# EAGLE design mainboard (EAGLE 9.6.2)

## Sheet 1 of 3: CPU - GPU
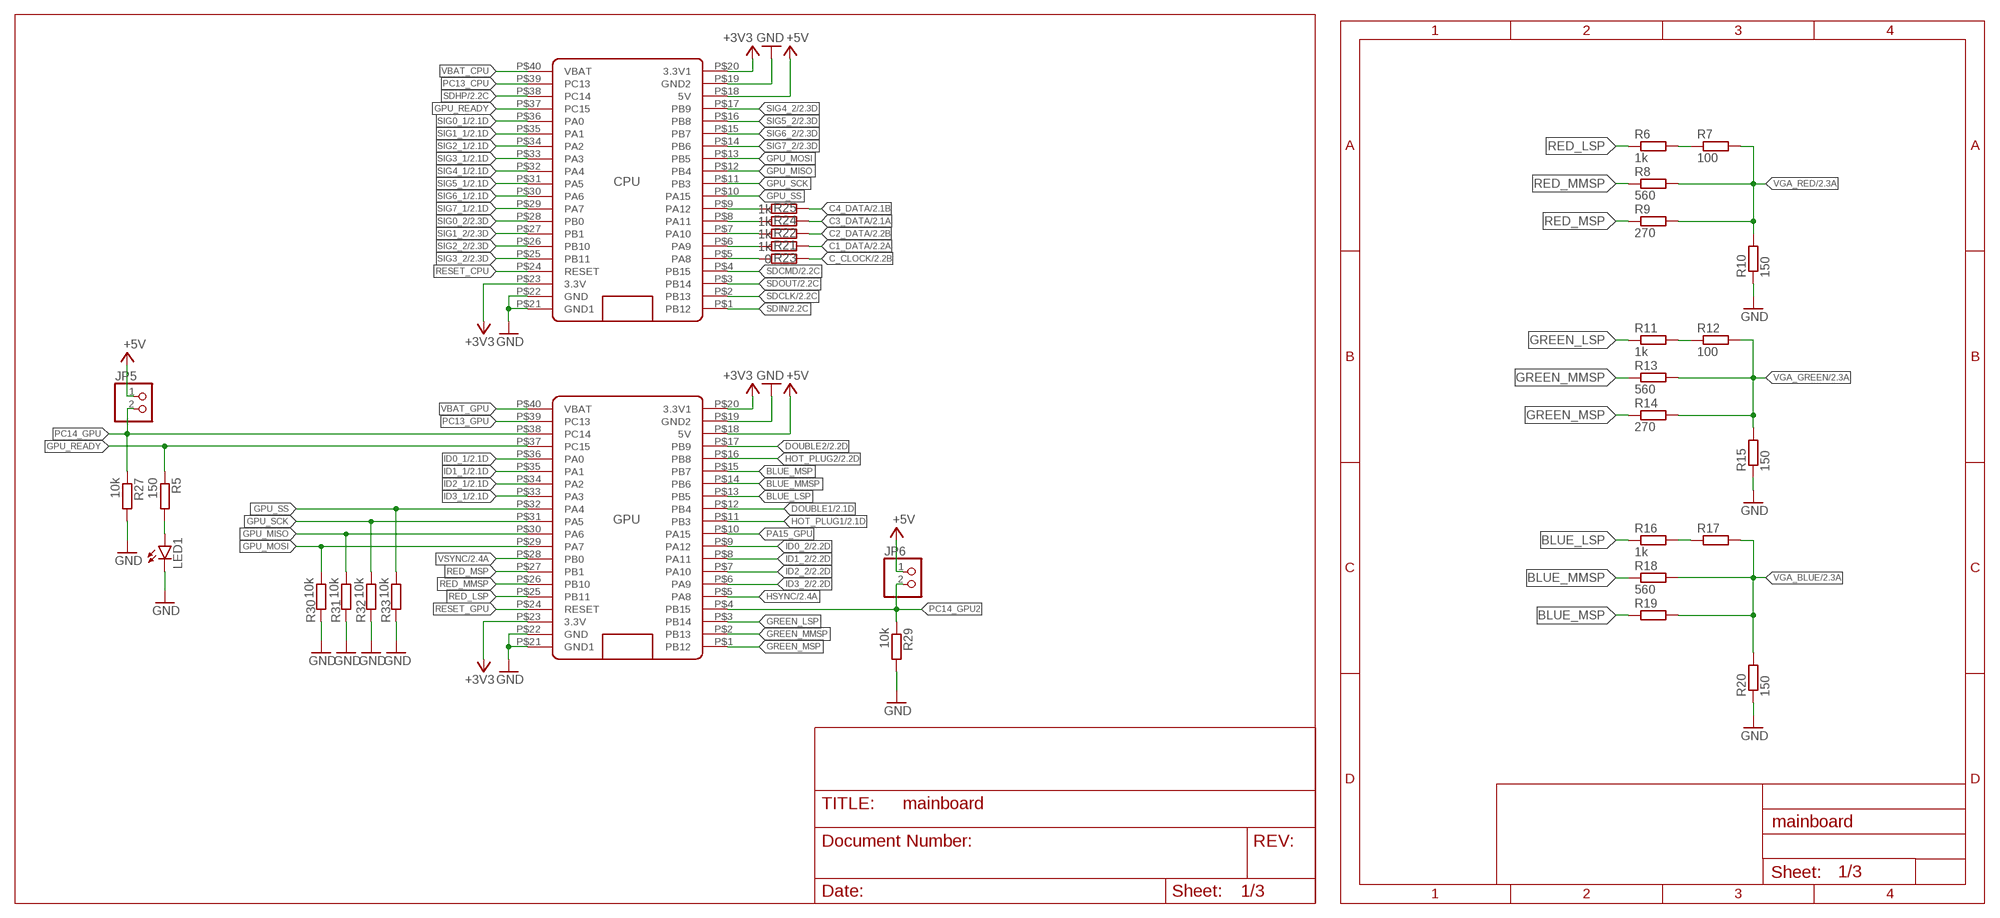
[diagram p0: schematic, sheet 1]

### Parts
CPU  BLUE_PILLADVANCED  [BLUE_PILL_ADV]
GPU  BLUE_PILLADVANCED  [BLUE_PILL_ADV]
JP5  PINHD-1X2  [1X02]
JP6  PINHD-1X2  [1X02]
LED1  LEDCHIPLED_0805  [CHIPLED_0805]
R5  150  R-EU_R0805  [R0805]
R6  1k  R-EU_R0805  [R0805]
R7  100  R-EU_R0805  [R0805]
R8  560  R-EU_R0805  [R0805]
R9  270  R-EU_R0805  [R0805]
R10  150  R-EU_R0805  [R0805]
R11  1k  R-EU_R0805  [R0805]
R12  100  R-EU_R0805  [R0805]
R13  560  R-EU_R0805  [R0805]
R14  270  R-EU_R0805  [R0805]
R15  150  R-EU_R0805  [R0805]
R16  1k  R-EU_R0805  [R0805]
R17  100  R-EU_R0805  [R0805]
R18  560  R-EU_R0805  [R0805]
R19  270  R-EU_R0805  [R0805]
R20  150  R-EU_R0805  [R0805]
R21  1k  R-EU_R0805  [R0805]
R22  1k  R-EU_R0805  [R0805]
R23  0  R-EU_R0805  [R0805]
R24  1k  R-EU_R0805  [R0805]
R25  1k  R-EU_R0805  [R0805]
R27  10k  R-EU_R0805  [R0805]
R29  10k  R-EU_R0805  [R0805]
R30  10k  R-EU_R0805  [R0805]
R31  10k  R-EU_R0805  [R0805]
R32  10k  R-EU_R0805  [R0805]
R33  10k  R-EU_R0805  [R0805]

### Nets
+3V3: CPU.P$20(3.3V1) CPU.P$23(3.3V) GPU.P$20(3.3V1) GPU.P$23(3.3V) ; also sheet 2
+5V: CPU.P$18(5V) GPU.P$18(5V) JP5.1 JP6.1 ; also sheet 2
BLUE_LSP: GPU.P$13(PB5) R16.1
BLUE_MMSP: GPU.P$14(PB6) R18.1
BLUE_MSP: GPU.P$15(PB7) R19.1
C1_DATA: R21.1 ; also sheet 2
C2_DATA: R22.1 ; also sheet 2
C3_DATA: R24.1 ; also sheet 2
C4_DATA: R25.1 ; also sheet 2
C_CLOCK: R23.1 ; also sheet 2
DOUBLE1: GPU.P$12(PB4) ; also sheet 2
DOUBLE2: GPU.P$17(PB9) ; also sheet 2
GND: CPU.P$19(GND2) CPU.P$21(GND1) CPU.P$22(GND) GPU.P$19(GND2) GPU.P$21(GND1) GPU.P$22(GND) LED1.C R10.1 R15.1 R20.1 R27.2 R29.2 R30.2 R31.2 R32.2 R33.2 ; also sheet 2
GPU_MISO: CPU.P$12(PB4) GPU.P$30(PA6) R31.1
GPU_MOSI: CPU.P$13(PB5) GPU.P$29(PA7) R30.1
GPU_READY: CPU.P$37(PC15) GPU.P$37(PC15) R5.1
GPU_SCK: CPU.P$11(PB3) GPU.P$31(PA5) R32.1
GPU_SS: CPU.P$10(PA15) GPU.P$32(PA4) R33.1
GREEN_LSP: GPU.P$3(PB14) R11.1
GREEN_MMSP: GPU.P$2(PB13) R13.1
GREEN_MSP: GPU.P$1(PB12) R14.1
HOT_PLUG1: GPU.P$11(PB3) ; also sheet 2
HOT_PLUG2: GPU.P$16(PB8) ; also sheet 2
HSYNC: GPU.P$5(PA8) ; also sheet 2
ID0_1: GPU.P$36(PA0) ; also sheet 2
ID0_2: GPU.P$9(PA12) ; also sheet 2
ID1_1: GPU.P$35(PA1) ; also sheet 2
ID1_2: GPU.P$8(PA11) ; also sheet 2
ID2_1: GPU.P$34(PA2) ; also sheet 2
ID2_2: GPU.P$7(PA10) ; also sheet 2
ID3_1: GPU.P$33(PA3) ; also sheet 2
ID3_2: GPU.P$6(PA9) ; also sheet 2
N$1: LED1.A R5.2
N$16: R6.2 R7.1
N$18: R11.2 R12.1
N$21: R16.2 R17.1
PA8_CPU: CPU.P$5(PA8) R23.2
PA9_CPU: CPU.P$6(PA9) R21.2
PA9_CPU1: CPU.P$8(PA11) R24.2
PA10_CPU: CPU.P$7(PA10) R22.2
PA10_CPU1: CPU.P$9(PA12) R25.2
PA15_GPU: GPU.P$10(PA15)
PC13_CPU: CPU.P$39(PC13)
PC13_GPU: GPU.P$39(PC13)
PC14_GPU: GPU.P$38(PC14) JP5.2 R27.1
PC14_GPU2: GPU.P$4(PB15) JP6.2 R29.1
RED_LSP: GPU.P$25(PB11) R6.1
RED_MMSP: GPU.P$26(PB10) R8.1
RED_MSP: GPU.P$27(PB1) R9.1
RESET_CPU: CPU.P$24(RESET)
RESET_GPU: GPU.P$24(RESET)
SDCLK: CPU.P$2(PB13) ; also sheet 2
SDCMD: CPU.P$4(PB15) ; also sheet 2
SDHP: CPU.P$38(PC14) ; also sheet 2
SDIN: CPU.P$1(PB12) ; also sheet 2
SDOUT: CPU.P$3(PB14) ; also sheet 2
SIG0_1: CPU.P$36(PA0) ; also sheet 2
SIG0_2: CPU.P$28(PB0) ; also sheet 2
SIG1_1: CPU.P$35(PA1) ; also sheet 2
SIG1_2: CPU.P$27(PB1) ; also sheet 2
SIG2_1: CPU.P$34(PA2) ; also sheet 2
SIG2_2: CPU.P$26(PB10) ; also sheet 2
SIG3_1: CPU.P$33(PA3) ; also sheet 2
SIG3_2: CPU.P$25(PB11) ; also sheet 2
SIG4_1: CPU.P$32(PA4) ; also sheet 2
SIG4_2: CPU.P$17(PB9) ; also sheet 2
SIG5_1: CPU.P$31(PA5) ; also sheet 2
SIG5_2: CPU.P$16(PB8) ; also sheet 2
SIG6_1: CPU.P$30(PA6) ; also sheet 2
SIG6_2: CPU.P$15(PB7) ; also sheet 2
SIG7_1: CPU.P$29(PA7) ; also sheet 2
SIG7_2: CPU.P$14(PB6) ; also sheet 2
VBAT_CPU: CPU.P$40(VBAT)
VBAT_GPU: GPU.P$40(VBAT)
VGA_BLUE: R17.2 R18.2 R19.2 R20.2 ; also sheet 2
VGA_GREEN: R12.2 R13.2 R14.2 R15.2 ; also sheet 2
VGA_RED: R7.2 R8.2 R9.2 R10.2 ; also sheet 2
VSYNC: GPU.P$28(PB0) ; also sheet 2

## Sheet 2 of 3: I/O
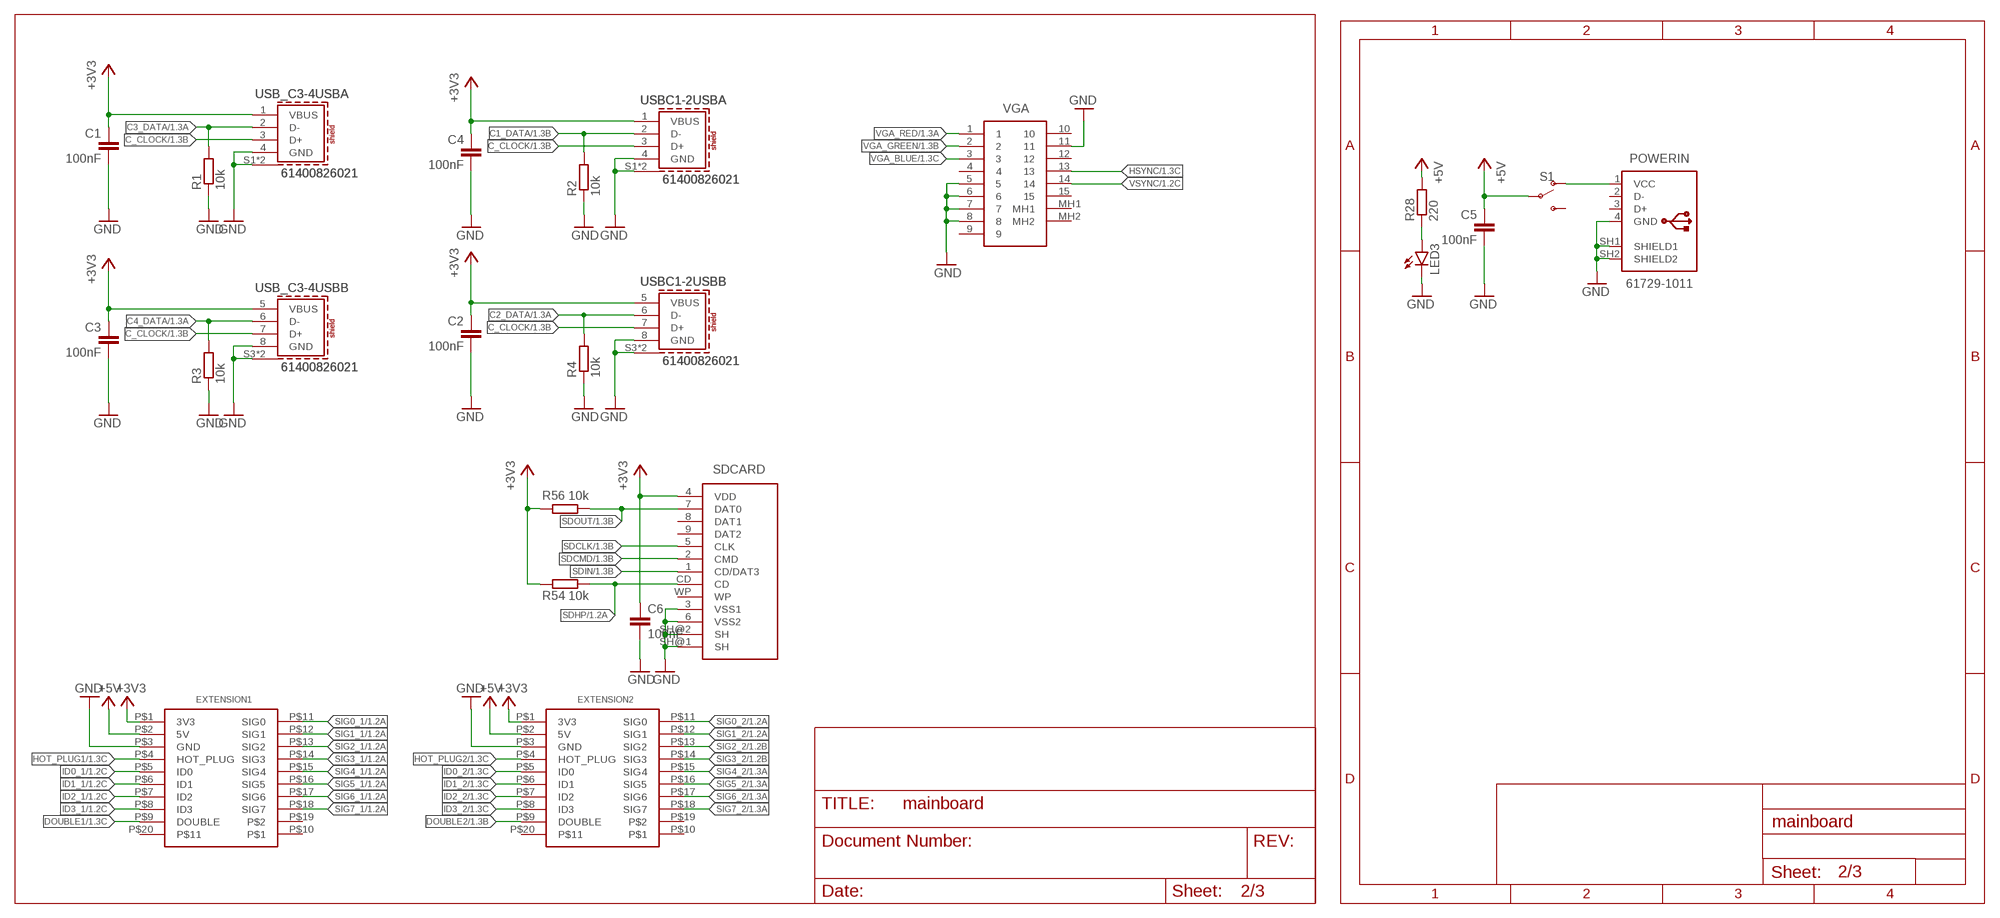
[diagram p1: schematic, sheet 2]

### Parts
C1  100nF  C-EUC0805  [C0805]
C2  100nF  C-EUC0805  [C0805]
C3  100nF  C-EUC0805  [C0805]
C4  100nF  C-EUC0805  [C0805]
C5  100nF  C-EUC0805  [C0805]
C6  100nF  C-EUC0805  [C0805]
EXTENSION1  3511220BMSS0BNA1_2.54MM_2X20_MALE  [3511220BMSS0BNA1_2.54MM_2X20_MALE]
EXTENSION2  3511220BMSS0BNA1_2.54MM_2X20_MALE  [3511220BMSS0BNA1_2.54MM_2X20_MALE]
LED3  LEDCHIPLED_0805  [CHIPLED_0805]
POWERIN  61729-1011  [61729-1011BLF]
R1  10k  R-EU_R0805  [R0805]
R2  10k  R-EU_R0805  [R0805]
R3  10k  R-EU_R0805  [R0805]
R4  10k  R-EU_R0805  [R0805]
R28  220  R-EU_R0805  [R0805]
R54  10k  R-EU_R0805  [R0805]
R56  10k  R-EU_R0805  [R0805]
S1  SWITCH-SPDT-PTH-11.6X4.0MM  [SWITCH_SPDT_PTH_11.6X4.0MM]
SD-CARD  SD_CARD_SOCKET  [SD]
USB_C3-4  61400826021  61400826021  [61400826021]
USBC1-2  61400826021  61400826021  [61400826021]
VGA  L77HDE15SD1CH4RHNVGA  [L77HDE15SD1CH4RHNVGA]

### Nets
+3V3: C1.1 C2.1 C3.1 C4.1 C6.1 EXTENSION1.P$1(3V3) EXTENSION2.P$1(3V3) R54.2 R56.2 SD-CARD.4(VDD) USB_C3-4.1(USBA:VBUS) USB_C3-4.5(USBB:VBUS) USBC1-2.1(USBA:VBUS) USBC1-2.5(USBB:VBUS) ; also sheet 1
+5V: C5.1 EXTENSION1.P$2(5V) EXTENSION2.P$2(5V) R28.2 S1.2(P) ; also sheet 1
C1_DATA: R2.2 USBC1-2.2(USBA:D-) ; also sheet 1
C2_DATA: R4.2 USBC1-2.6(USBB:D-) ; also sheet 1
C3_DATA: R1.2 USB_C3-4.2(USBA:D-) ; also sheet 1
C4_DATA: R3.2 USB_C3-4.6(USBB:D-) ; also sheet 1
C_CLOCK: USB_C3-4.3(USBA:D+) USB_C3-4.7(USBB:D+) USBC1-2.3(USBA:D+) USBC1-2.7(USBB:D+) ; also sheet 1
DOUBLE1: EXTENSION1.P$9(DOUBLE) ; also sheet 1
DOUBLE2: EXTENSION2.P$9(DOUBLE) ; also sheet 1
GND: C1.2 C2.2 C3.2 C4.2 C5.2 C6.2 EXTENSION1.P$3(GND) EXTENSION2.P$3(GND) LED3.C POWERIN.4(GND) POWERIN.SH1(SHIELD1) POWERIN.SH2(SHIELD2) R1.1 R2.1 R3.1 R4.1 SD-CARD.3(VSS1) SD-CARD.6(VSS2) SD-CARD.SH@1(SH) SD-CARD.SH@2(SH) USB_C3-4.4(USBA:GND) USB_C3-4.8(USBB:GND) USB_C3-4.S1(USBA:SHIELD) USB_C3-4.S2(USBA:SHIELD) USB_C3-4.S3(USBB:SHIELD) USB_C3-4.S4(USBB:SHIELD) USBC1-2.4(USBA:GND) USBC1-2.8(USBB:GND) USBC1-2.S1(USBA:SHIELD) USBC1-2.S2(USBA:SHIELD) USBC1-2.S3(USBB:SHIELD) USBC1-2.S4(USBB:SHIELD) VGA.5 VGA.6 VGA.7 VGA.8 VGA.11 ; also sheet 1
HOT_PLUG1: EXTENSION1.P$4(HOT_PLUG) ; also sheet 1
HOT_PLUG2: EXTENSION2.P$4(HOT_PLUG) ; also sheet 1
HSYNC: VGA.13 ; also sheet 1
ID0_1: EXTENSION1.P$5(ID0) ; also sheet 1
ID0_2: EXTENSION2.P$5(ID0) ; also sheet 1
ID1_1: EXTENSION1.P$6(ID1) ; also sheet 1
ID1_2: EXTENSION2.P$6(ID1) ; also sheet 1
ID2_1: EXTENSION1.P$7(ID2) ; also sheet 1
ID2_2: EXTENSION2.P$7(ID2) ; also sheet 1
ID3_1: EXTENSION1.P$8(ID3) ; also sheet 1
ID3_2: EXTENSION2.P$8(ID3) ; also sheet 1
N$3: POWERIN.1(VCC) S1.1(O)
N$4: LED3.A R28.1
SDCLK: SD-CARD.5(CLK) ; also sheet 1
SDCMD: SD-CARD.2(CMD) ; also sheet 1
SDHP: R54.1 SD-CARD.CD ; also sheet 1
SDIN: SD-CARD.1(CD/DAT3) ; also sheet 1
SDOUT: R56.1 SD-CARD.7(DAT0) ; also sheet 1
SIG0_1: EXTENSION1.P$11(SIG0) ; also sheet 1
SIG0_2: EXTENSION2.P$11(SIG0) ; also sheet 1
SIG1_1: EXTENSION1.P$12(SIG1) ; also sheet 1
SIG1_2: EXTENSION2.P$12(SIG1) ; also sheet 1
SIG2_1: EXTENSION1.P$13(SIG2) ; also sheet 1
SIG2_2: EXTENSION2.P$13(SIG2) ; also sheet 1
SIG3_1: EXTENSION1.P$14(SIG3) ; also sheet 1
SIG3_2: EXTENSION2.P$14(SIG3) ; also sheet 1
SIG4_1: EXTENSION1.P$15(SIG4) ; also sheet 1
SIG4_2: EXTENSION2.P$15(SIG4) ; also sheet 1
SIG5_1: EXTENSION1.P$16(SIG5) ; also sheet 1
SIG5_2: EXTENSION2.P$16(SIG5) ; also sheet 1
SIG6_1: EXTENSION1.P$17(SIG6) ; also sheet 1
SIG6_2: EXTENSION2.P$17(SIG6) ; also sheet 1
SIG7_1: EXTENSION1.P$18(SIG7) ; also sheet 1
SIG7_2: EXTENSION2.P$18(SIG7) ; also sheet 1
VGA_BLUE: VGA.3 ; also sheet 1
VGA_GREEN: VGA.2 ; also sheet 1
VGA_RED: VGA.1 ; also sheet 1
VSYNC: VGA.14 ; also sheet 1
Unconnected: EXTENSION1.P$10 EXTENSION1.P$19 EXTENSION1.P$20 EXTENSION2.P$10 EXTENSION2.P$19 EXTENSION2.P$20 POWERIN.2(D-) POWERIN.3(D+) S1.3(S) SD-CARD.8(DAT1) SD-CARD.9(DAT2) SD-CARD.WP VGA.4 VGA.9 VGA.10 VGA.12 VGA.15 VGA.MH1 VGA.MH2

## Sheet 3 of 3: Controller
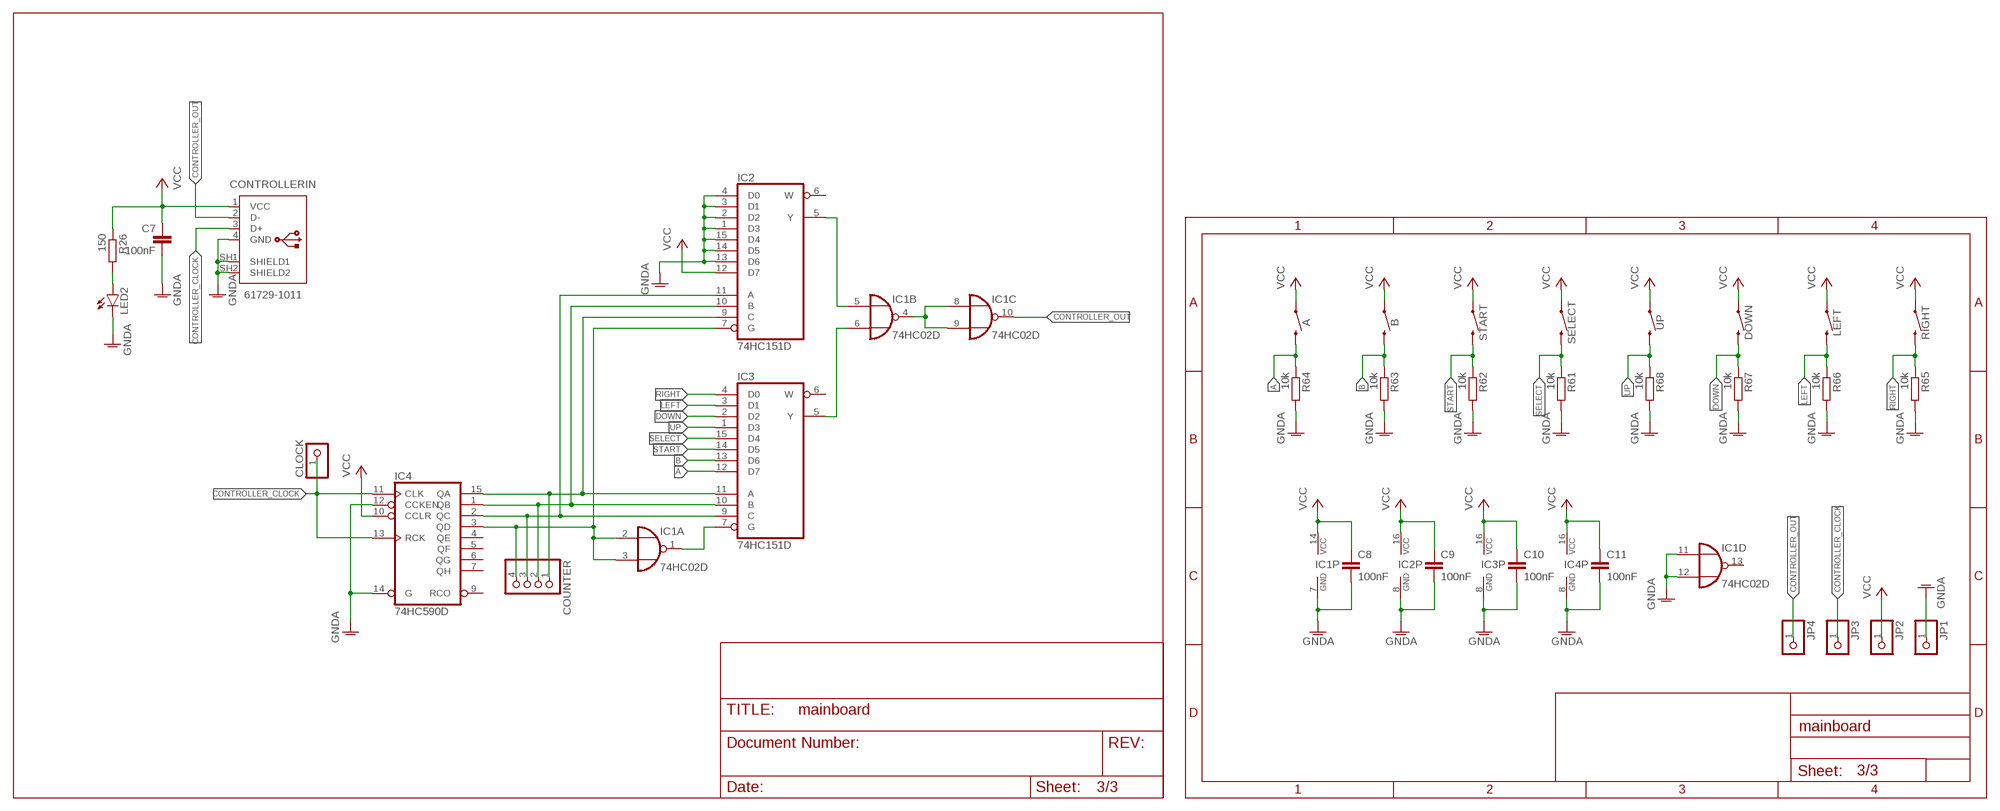
[diagram p2: schematic, sheet 3]

### Parts
A  MOMENTARY-SWITCH-SPST-PTH-12MM  [TACTILE_SWITCH_PTH_12MM]
B  MOMENTARY-SWITCH-SPST-PTH-12MM  [TACTILE_SWITCH_PTH_12MM]
C7  100nF  C-EUC0805  [C0805]
C8  100nF  C-EUC0805  [C0805]
C9  100nF  C-EUC0805  [C0805]
C10  100nF  C-EUC0805  [C0805]
C11  100nF  C-EUC0805  [C0805]
CLOCK  PINHD-1X1  [1X01]
CONTROLLERIN  61729-1011  [61729-1011BLF]
COUNTER  PINHD-1X4  [1X04]
DOWN  MOMENTARY-SWITCH-SPST-PTH-12MM  [TACTILE_SWITCH_PTH_12MM]
IC1  74HC02D  [SO14]
IC2  74HC151D  [SO16]
IC3  74HC151D  [SO16]
IC4  74HC590D  [SO16]
JP1  PINHD-1X1  [1X01]
JP2  PINHD-1X1  [1X01]
JP3  PINHD-1X1  [1X01]
JP4  PINHD-1X1  [1X01]
LED2  LEDCHIPLED_0805  [CHIPLED_0805]
LEFT  MOMENTARY-SWITCH-SPST-PTH-12MM  [TACTILE_SWITCH_PTH_12MM]
R26  150  R-EU_R0805  [R0805]
R61  10k  R-EU_R0805  [R0805]
R62  10k  R-EU_R0805  [R0805]
R63  10k  R-EU_R0805  [R0805]
R64  10k  R-EU_R0805  [R0805]
R65  10k  R-EU_R0805  [R0805]
R66  10k  R-EU_R0805  [R0805]
R67  10k  R-EU_R0805  [R0805]
R68  10k  R-EU_R0805  [R0805]
RIGHT  MOMENTARY-SWITCH-SPST-PTH-12MM  [TACTILE_SWITCH_PTH_12MM]
SELECT  MOMENTARY-SWITCH-SPST-PTH-12MM  [TACTILE_SWITCH_PTH_12MM]
START  MOMENTARY-SWITCH-SPST-PTH-12MM  [TACTILE_SWITCH_PTH_12MM]
UP  MOMENTARY-SWITCH-SPST-PTH-12MM  [TACTILE_SWITCH_PTH_12MM]

### Nets
A: A.3 IC3.12(D7) R64.1
B: B.3 IC3.13(D6) R63.1
CONTROLLER_CLOCK: CLOCK.1 CONTROLLERIN.3(D+) IC4.11(CLK) IC4.13(RCK) JP3.1
CONTROLLER_OUT: CONTROLLERIN.2(D-) IC1.10(C:O) JP4.1
DOWN: DOWN.3 IC3.2(D2) R67.1
GNDA: C7.2 C8.2 C9.2 C10.2 C11.2 CONTROLLERIN.4(GND) CONTROLLERIN.SH1(SHIELD1) CONTROLLERIN.SH2(SHIELD2) IC1.7(P:GND) IC1.11(D:I0) IC1.12(D:I1) IC2.1(D3) IC2.2(D2) IC2.3(D1) IC2.4(D0) IC2.8(GND) IC2.13(D6) IC2.14(D5) IC2.15(D4) IC3.8(GND) IC4.8(GND) IC4.12(CCKEN) IC4.14(G) JP1.1 LED2.C R61.2 R62.2 R63.2 R64.2 R65.2 R66.2 R67.2 R68.2
LEFT: IC3.3(D1) LEFT.3 R66.1
N$2: LED2.A R26.2
N$11: IC1.5(B:I0) IC2.5(Y)
N$15: IC1.6(B:I1) IC3.5(Y)
N$17: IC1.4(B:O) IC1.8(C:I0) IC1.9(C:I1)
N$24: COUNTER.1 IC2.9(C) IC3.11(A) IC4.15(QA)
N$25: COUNTER.2 IC2.10(B) IC3.10(B) IC4.1(QB)
N$26: COUNTER.3 IC2.11(A) IC3.9(C) IC4.2(QC)
N$27: COUNTER.4 IC1.2(A:I0) IC1.3(A:I1) IC2.7(G) IC4.3(QD)
N$29: IC1.1(A:O) IC3.7(G)
RIGHT: IC3.4(D0) R65.1 RIGHT.3
SELECT: IC3.15(D4) R61.1 SELECT.3
START: IC3.14(D5) R62.1 START.3
UP: IC3.1(D3) R68.1 UP.3
VCC: A.1 B.1 C7.1 C8.1 C9.1 C10.1 C11.1 CONTROLLERIN.1(VCC) DOWN.1 IC1.14(P:VCC) IC2.12(D7) IC2.16(VCC) IC3.16(VCC) IC4.10(CCLR) IC4.16(VCC) JP2.1 LEFT.1 R26.1 RIGHT.1 SELECT.1 START.1 UP.1
Unconnected: IC1.13(D:O) IC2.6(W) IC3.6(W) IC4.4(QE) IC4.5(QF) IC4.6(QG) IC4.7(QH) IC4.9(RCO)

## Library data of the parts
A B DOWN LEFT RIGHT SELECT START UP = SparkFun-Switches:MOMENTARY-SWITCH-SPST: Momentary Switch (Pushbutton) - SPST Normally-open (NO) SPST momentary switches (buttons, pushbuttons). Variants PTH-12MM - 12mm square, through-hole Momentary Pushbutton Switch - 12mm Square <https://www.sparkfun.com/products/9190> (COM-09190) PTH-6.0MM, PTH-6.0MM-KIT - 6.0mm square, through-hole Mini Pushbutton Switch <https://www.sparkfun.com/products/97> (COM-00097) KIT package intended for soldering kit's - only one side of pads' copper is exposed. PTH-RIGHT-ANGLE-KIT - Right-angle, through-hole Right Angle Tactile Button <https://www.sparkfun.com/products/10791> - Used on SparkFun BigTime Watch Kit <https://www.sparkfun.com/products/11734> SMD-12MM - 12mm square, surface-mount Tactile Button - SMD (12mm) <https://www.sparkfun.com/products/12993> (COM-12993) Used on SparkFun PicoBoard <https://www.sparkfun.com/products/11888> SMD-4.5MM - 4.5mm Square Trackball Switch Used on SparkFun Blackberry Trackballer Breakout <https://www.sparkfun.com/products/13169> SMD-4.6MMX2.8MM - 4.60mm x 2.80mm, surface mount Used on SparkFun SAMD21 Mini Breakout <https://www.sparkfun.com/products/13664> SMD-5.2MM, SMD-5.2-REDUNDANT - 5.2mm square, surface-mount Mini Pushbutton Switch - SMD <https://www.sparkfun.com/products/8720> (COM-08720) Used on Arduino Pro Mini <https://www.sparkfun.com/products/11114> REDUNDANT package connects both switch circuits together SMD-6.0X3.5MM - 6.0 x 3.5mm, surface mount Momentary Reset Switch SMD <https://www.sparkfun.com/products/8229> (COM-08229) SMD-6.2MM-TALL - 6.2mm square, surface mount Tactile Button - SMD (6mm) <https://www.sparkfun.com/products/12992> Used on SparkFun Digital Sandbox <https://www.sparkfun.com/products/12651> SMD-RIGHT-ANGLE - Right-angle, surface mount Used on SparkFun Block for Intel® Edison - Arduino <https://www.sparkfun.com/products/13036>; PROD_ID: SWCH-09185; SF_SKU: COM-09190
C1-C11 = rcl:C-EU: CAPACITOR, European symbol; SPICEPREFIX: C
CLOCK JP1-JP4 = pinhead:PINHD-1X1: PIN HEADER
CONTROLLERIN POWERIN = Connector_USB:61729-1011: USB(2.0) Type-B, RCPT, 4POS, THT-R/A Datasheet <https://www.amphenol-icc.com/media/wysiwyg/files/drawing/61729.pdf>; CATEGORY: Connector; CONTACTS: 4; CURRENT_RATING: 1A; DESCRIPTION: CONN RCPT USB2.0 TYPEB 4POS R/A; GENDER: Receptacle; MANUFACTURER: Amphenol ICC (FCI); MOUNT_TYPE: R/A; MPN: 61729-1011BLF; OPERATING_TEMP: -55°C to 85°C; PART_STATUS: Active; ROHS_COMPLIANT: RoHS Compliant; SERIES: 61729; SUB-CATEGORY: USB; TYPE: USB-B
COUNTER = pinhead:PINHD-1X4: PIN HEADER
CPU GPU = BluePill:BLUE_PILL
EXTENSION1 EXTENSION2 = BtoB_connector:3511220BMSS0BNA1_2.54MM_2X20_MALE
IC1 = 74xx-eu:74*02: Quad 2-input NOR gate
IC2 IC3 = 74xx-eu:74*151: Data SELECTOR/MULTIPLEXER
IC4 = 74xx-eu:74*590: 8-bit binary COUNTER, output register
JP5 JP6 = pinhead:PINHD-1X2: PIN HEADER
LED1-LED3 = led:LED: LED OSRAM: - CHIPLED LG R971, LG N971, LY N971, LG Q971, LY Q971, LO R971, LY R971 LH N974, LH R974 LS Q976, LO Q976, LY Q976 LO Q996 - Hyper CHIPLED LW Q18S LB Q993, LB Q99A, LB R99A - SideLED LS A670, LO A670, LY A670, LG A670, LP A670 LB A673, LV A673, LT A673, LW A673 LH A674 LY A675 LS A676, LA A676, LO A676, LY A676, LW A676 LS A679, LY A679, LG A679 - Hyper Micro SIDELED® LS Y876, LA Y876, LO Y876, LY Y876 LT Y87S - SmartLED LW L88C, LW L88S LB L89C, LB L89S, LG L890 LS L89K, LO L89K, LY L89K LS L896, LA L896, LO L896, LY L896 - TOPLED LS T670, LO T670, LY T670, LG T670, LP T670 LSG T670, LSP T670, LSY T670, LOP T670, LYG T670 LG T671, LOG T671, LSG T671 LB T673, LV T673, LT T673, LW T673 LH T674 LS T676, LA T676, LO T676, LY T676, LB T676, LH T676, LSB T676, LW T676 LB T67C, LV T67C, LT T67C, LS T67K, LO T67K, LY T67K, LW E67C LS E67B, LA E67B, LO E67B, LY E67B, LB E67C, LV E67C, LT E67C LW T67C LS T679, LY T679, LG T679 LS T770, LO T770, LY T770, LG T770, LP T770 LB T773, LV T773, LT T773, LW T773 LH T774 LS E675, LA E675, LY E675, LS T675 LS T776, LA T776, LO T776, LY T776, LB T776 LHGB T686 LT T68C, LB T68C - Hyper Mini TOPLED® LB M676 - Mini TOPLED Santana® LG M470 LS M47K, LO M47K, LY M47K Source: http://www.osram.convergy.de LUXEON: - LUMILED® LXK2-PW12-R00, LXK2-PW12-S00, LXK2-PW14-U00, LXK2-PW14-V00 LXK2-PM12-R00, LXK2-PM12-S00, LXK2-PM14-U00 LXK2-PE12-Q00, LXK2-PE12-R00, LXK2-PE12-S00, LXK2-PE14-T00, LXK2-PE14-U00 LXK2-PB12-K00, LXK2-PB12-L00, LXK2-PB12-M00, LXK2-PB14-N00, LXK2-PB14-P00, LXK2-PB14-Q00 LXK2-PR12-L00, LXK2-PR12-M00, LXK2-PR14-Q00, LXK2-PR14-R00 LXK2-PD12-Q00, LXK2-PD12-R00, LXK2-PD12-S00 LXK2-PH12-R00, LXK2-PH12-S00 LXK2-PL12-P00, LXK2-PL12-Q00, LXK2-PL12-R00 Source: www.luxeon.com KINGBRIGHT: KA-3528ASYC Source: www.kingbright.com
R1-R33 R54 R56 R61-R68 = rcl:R-EU_: RESISTOR, European symbol; SPICEPREFIX: R
S1 = switches_SparkFun-Switches:SWITCH-SPDT: Single Pole, Double Throw (SPDT) Switch Single-pole, double-throw (SPDT) switch. Variant Overview SMD-AYZ0202 Surface Mount DPDT Switch <https://www.sparkfun.com/products/597> (COM-00597) Used on e.g. LilyPad Arduino USB - ATmega32U4 Board <https://www.sparkfun.com/products/12049> PTH-11.6X4.0MM SPDT Mini Power Switch <https://www.sparkfun.com/products/102> (COM-00102) Used on e.g. SparkFun Simon Says - Through-Hole Soldering Kit <https://www.sparkfun.com/products/10547> (KIT-10547) PTH-11.6X4.0MM-KIT KIT version of SPDT Mini Power Switch - Simplifies soldering by removing tStop of switch pins - only one side can be soldered. PTH-11.6X4.0MM-LOCK LOCK version of SPDT Mini Power Switch - Offset pins hold switch in place for easier soldering. SMD-RIGHT-ANGLE Surface Mount Right Angle Switch <https://www.sparkfun.com/products/10860> (COM-10860) Used on e.g. SparkFun ESP8266 Thing <https://www.sparkfun.com/products/13231>; PROD_ID: SWCH-08261; SF_SKU: COM-00102
SD-CARD = sd_card_sparkfun:SD_CARD_SOCKET: SD Memory Card Connector (standard "large" size) Push-push normal type, CD enable, WP enable. Here is the connector we sell at SparkFun: SD/MMC Socket <https://www.sparkfun.com/products/12769> (PRT-12769) Datasheet <https://cdn.sparkfun.com/datasheets/Prototyping/19608.pdf> It is used on these SparkFun products: SparkFun SD/MMC Card Breakout <https://www.sparkfun.com/products/12941> (BOB-12941) SD Sniffer <https://www.sparkfun.com/products/11468> (TOL-11468); PROD_ID: CONN-11976; SF_ID: PRT-12769
USB_C3-4 USBC1-2 = Wurth_Connectors_WR-USB:61400826021: WR-COM USB 2.0 Type A Horizontal Dual Stacked Kind Properties Durability:1 500 Mating cycles Quality Class:1 500 Mating cycles Connector Type:USB Gender:Receptacle Type:Stacked Horizontal General Information Operating Temperature:-40up to +105 °C Compliance:RoHS Electrical Properties IR 1:1.5 A Working Voltage:30V (AC) Withstanding Voltage:750 V (AC) Contact Resistance:20 mΩ Material Properties Insulator Material:PBT Insulator Flammability Rating:UL94 V-0 Color:White Cover Material:Brass Cover Plating:Nickel Contact Material:Copper Alloy Contact Plating:Selective Gold Contact Type:Stamped Shielding Material:Brass Shielding Plating:Nickel <https://www.we-online.com/catalog/media/o32989v209%20Family_WR-COM_61400826021.jpg> Details see: https://www.we-online.com/catalog/en/COM_TYPE_A_HORIZONTAL_DUAL_STACKED/ Updated by Yingchun, Shan 2020-01-14 2020 (C) Würth Elektronik; APPLICATION: USB 2.0; DATASHEET-URL: https://www.we-online.com/redexpert/spec/61400826021?ae; GERDER: Receptacle; INTERFACE-TYPE: Type A; IR: 1.5A; MOUNT: THT; PACKAGING: Tray; PART-NUMBER: 61400826021; PINS: 8; TYPE: Stacked Horizontal; WORKING-VOLTAGE: 30V(AC)
VGA = L77HDE15SD1CH4RHNVGA:L77HDE15SD1CH4RHNVGA: D-Sub High Density Connectors Dsub, Stamped Signal 3A, High Density, Right Angle PCB Thru Hole, FP=8.89mm (.350"), 15 Socket, Bright Tin Shell, Flash Gold, 4-40 Rear Insert, Ground Tab with Boardlock, High Temp, Nickel Shell, VGA Source: Datasheet <https://componentsearchengine.com/Datasheets/1/L77HDE15SD1CH4RHNVGA.pdf>; ARROW_PART_NUMBER: L77HDE15SD1CH4RHNVGA; ARROW_PRICE-STOCK: https://www.arrow.com/en/products/l77hde15sd1ch4rhnvga/amphenol-fci?region=nac; DESCRIPTION: D-Sub High Density Connectors Dsub, Stamped Signal 3A, High Density, Right Angle PCB Thru Hole, FP=8.89mm (.350"), 15 Socket, Bright Tin Shell, Flash Gold, 4-40 Rear Insert, Ground Tab with Boardlock, High Temp, Nickel Shell, VGA; HEIGHT: 12.55mm; MANUFACTURER_NAME: Amphenol; MANUFACTURER_PART_NUMBER: L77HDE15SD1CH4RHNVGA; MOUSER_PART_NUMBER: 523-7HDE15SDH4RHNVGA; MOUSER_PRICE-STOCK: https://www.mouser.co.uk/ProductDetail/Amphenol-Commercial-Products/L77HDE15SD1CH4RHNVGA?qs=f9yNj16SXrKPVxRw%2FcVQYg%3D%3D

## Board
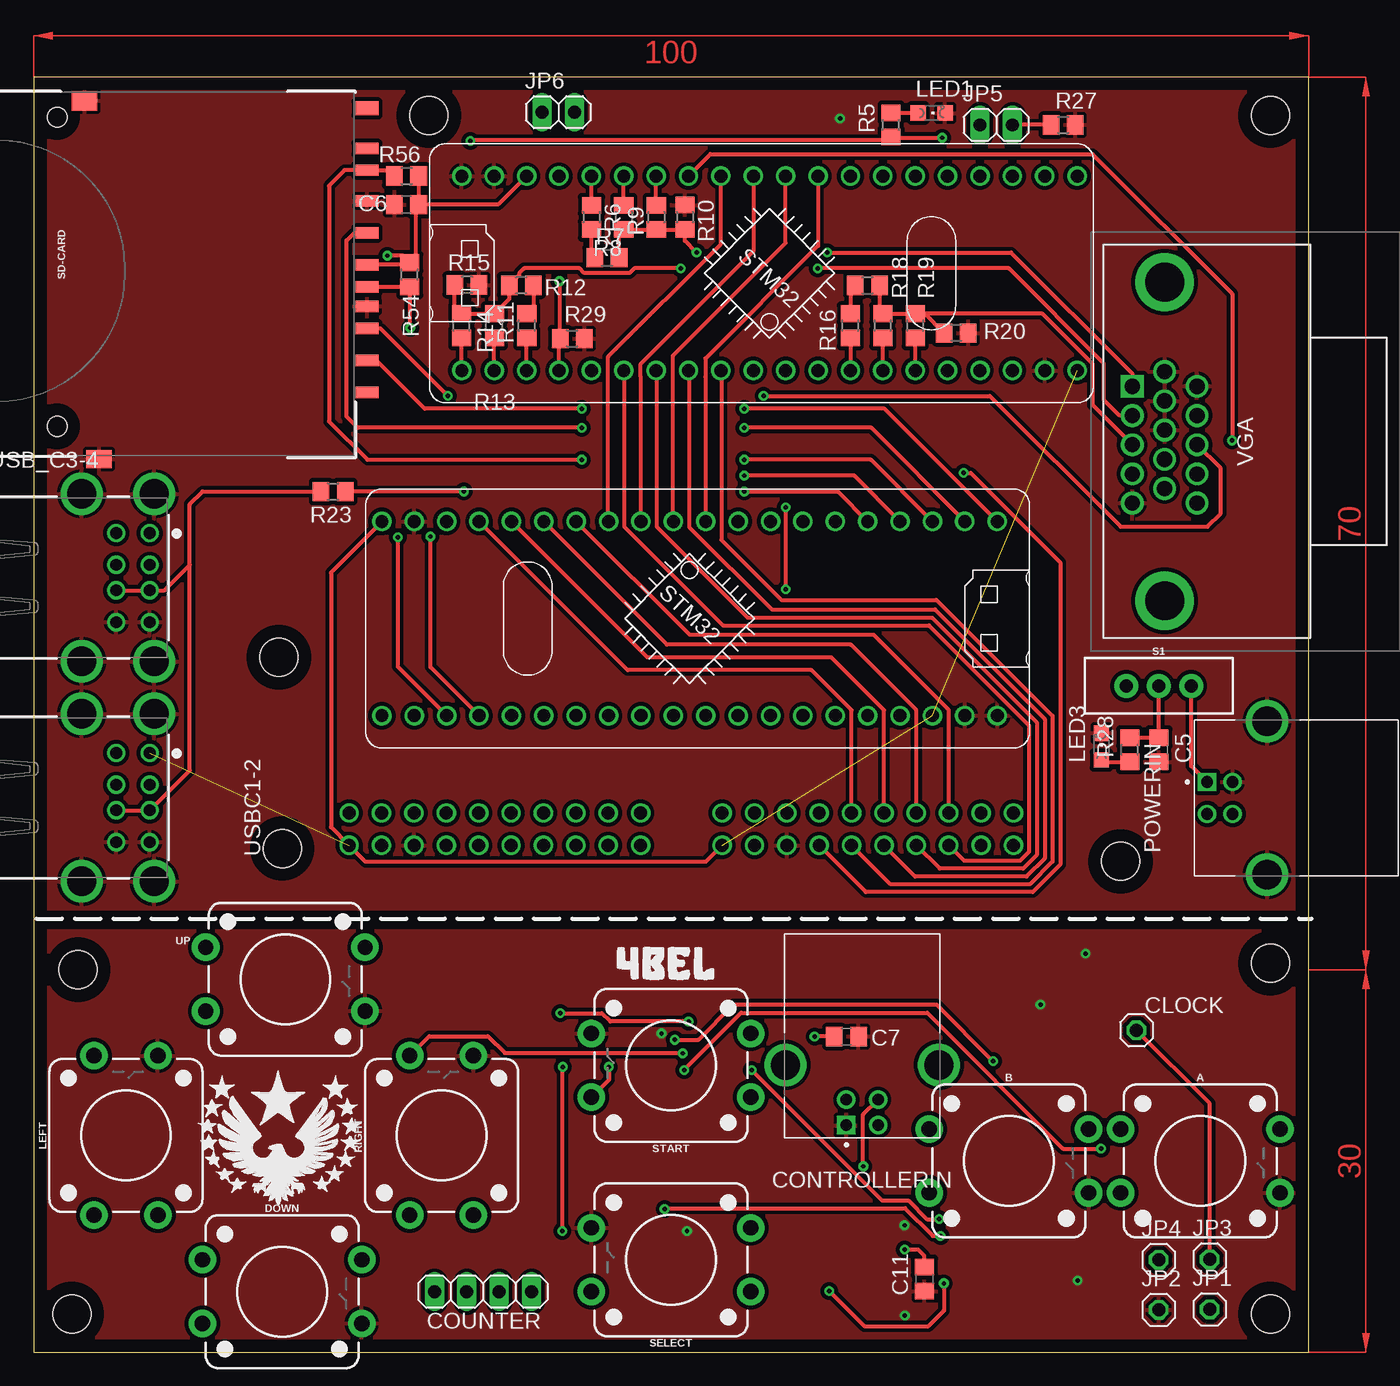
[diagram p3: board, top side]
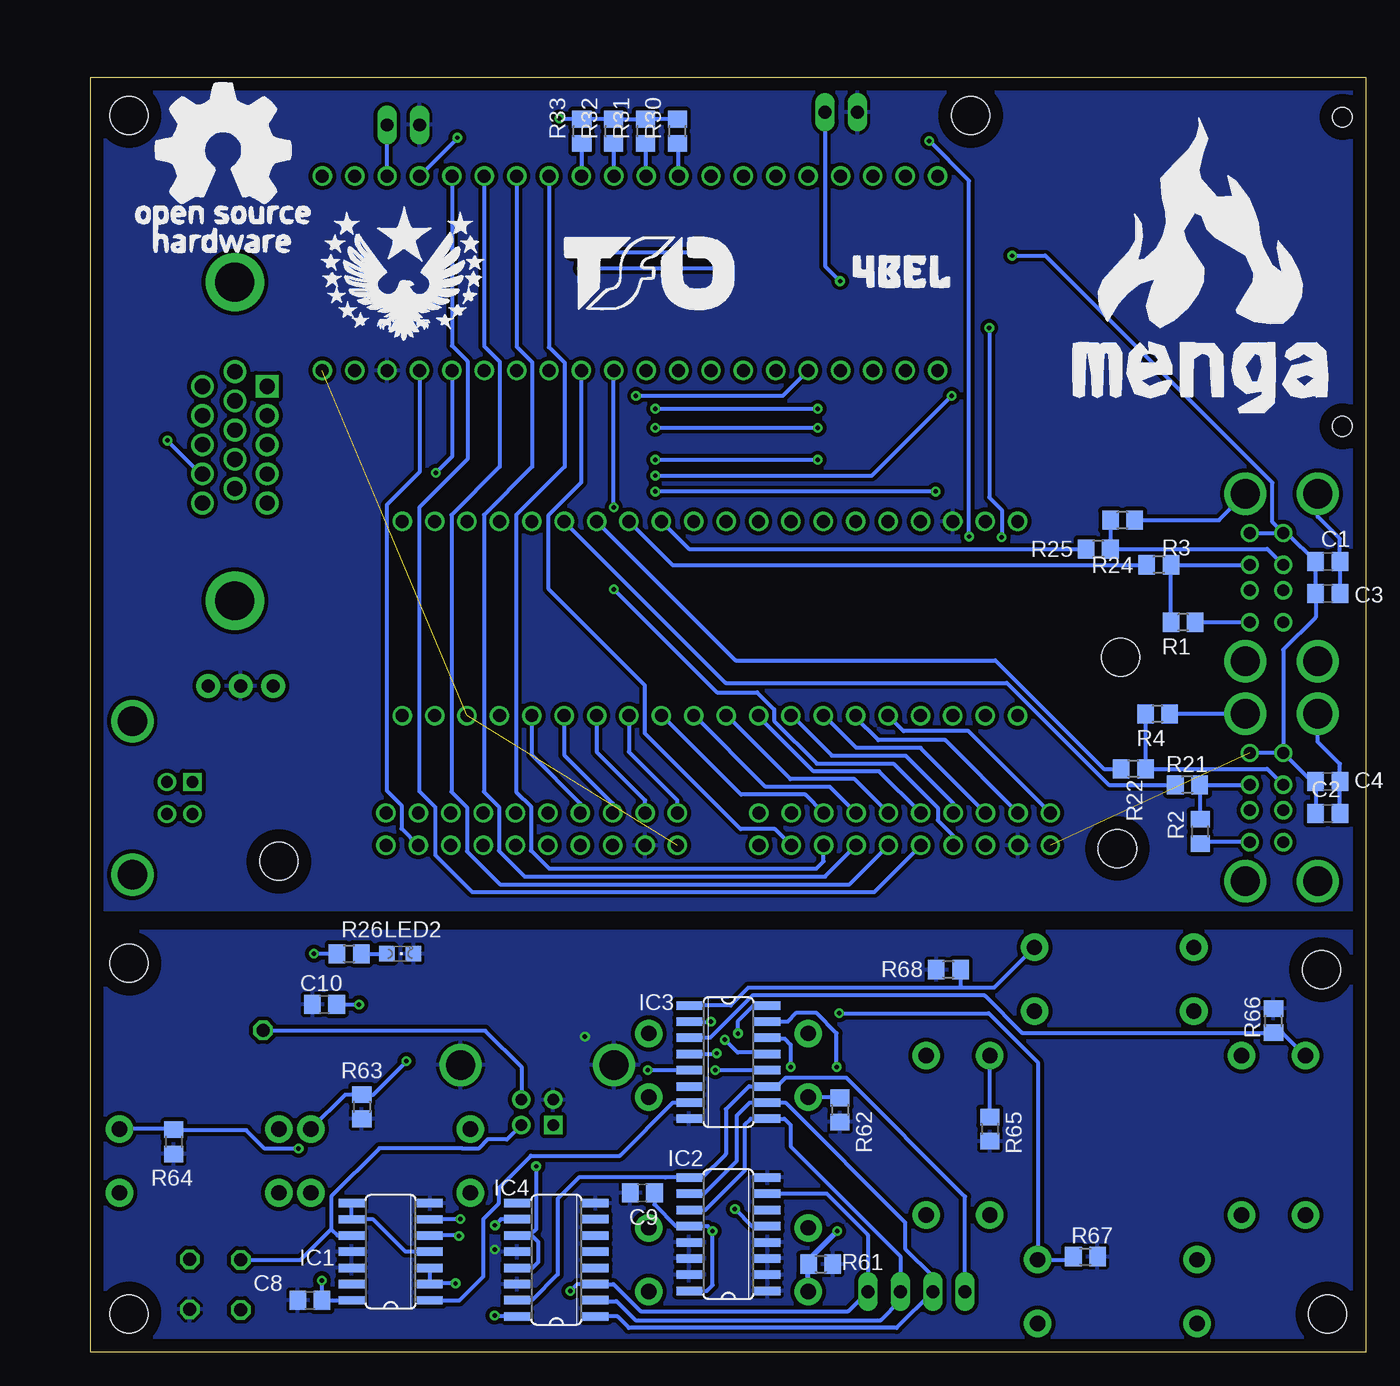
[diagram p4: board, bottom side, seen from below]

Size 100 x 100 mm. Coordinates in mm from the lower left corner, seen from the top.
Outline: 0,0 100,0 100,100 0,100 0,0
Copper layers (1*16): Top 0.035mm / dielectric 1.5mm / Bottom 0.035mm
Design rules "default *": minimum track width 12mil, minimum drill 0.35mm, track to track 12mil, track to pad 12mil, pad to pad 12mil, via to via 12mil, smd to smd 12mil, copper to edge 40mil, drill to drill 12mil, minimum pad ring 10mil, minimum via ring 8mil, stop-mask expansion 4mil, vias tented up to drill 0mil, thermal gap 10mil
Holes 3 mm at 3,3 97,3 97,30.5 3.5,30 97,97 31,97 19.5,39.5 85.25,38.5 19.25,54.5

### Footprints (pad centres in the part's own frame; a part is rotated, then mirrored left to right if it is on the bottom)
TACTILE_SWITCH_PTH_12MM = drill 1.2 pad 2.159: 1 6.25,-2.5; 2 -6.25,-2.5; 3 6.25,2.5; 4 -6.25,2.5
C0805 = smd 1.3 x 1.5: 1 -0.95,0; 2 0.95,0
1X01 = drill 1.016 octagon: 1 0,0
61729-1011BLF = drill 0.92 square: 1 1.25,4.71 | drill 0.92: 2 -1.25,4.71; 3 -1.25,2.71; 4 1.25,2.71 | drill 2.3: SH1 -6.02,0; SH2 6.02,0
1X04 = drill 1.016 long: 1 -3.81,0; 2 -1.27,0; 3 1.27,0; 4 3.81,0
BLUE_PILL_ADV = drill 1.016: P$1 10.16,-30.48; P$2 10.16,-27.94; P$3 10.16,-25.4; P$4 10.16,-22.86; P$5 10.16,-20.32; P$6 10.16,-17.78; P$7 10.16,-15.24; P$8 10.16,-12.7; P$9 10.16,-10.16; P$10 10.16,-7.62; P$11 10.16,-5.08; P$12 10.16,-2.54; P$13 10.16,0; P$14 10.16,2.54; P$15 10.16,5.08; P$16 10.16,7.62; P$17 10.16,10.16; P$18 10.16,12.7; P$19 10.16,15.24; P$20 10.16,17.78; P$21 -5.08,-30.48; P$22 -5.08,-27.94; P$23 -5.08,-25.4; P$24 -5.08,-22.86; P$25 -5.08,-20.32; P$26 -5.08,-17.78; P$27 -5.08,-15.24; P$28 -5.08,-12.7; P$29 -5.08,-10.16; P$30 -5.08,-7.62; P$31 -5.08,-5.08; P$32 -5.08,-2.54; P$33 -5.08,0; P$34 -5.08,2.54; P$35 -5.08,5.08; P$36 -5.08,7.62; P$37 -5.08,10.16; P$38 -5.08,12.7; P$39 -5.08,15.24; P$40 -5.08,17.78
3511220BMSS0BNA1_2.54MM_2X20_MALE = drill 1.016: P$1 0,0; P$2 2.54,0; P$3 5.08,0; P$4 7.62,0; P$5 10.16,0; P$6 12.7,0; P$7 15.24,0; P$8 17.78,0; P$9 20.32,0; P$10 22.86,0; P$11 0,2.54; P$12 2.54,2.54; P$13 5.08,2.54; P$14 7.62,2.54; P$15 10.16,2.54; P$16 12.7,2.54; P$17 15.24,2.54; P$18 17.78,2.54; P$19 20.32,2.54; P$20 22.86,2.54
SO14 = smd 0.66 x 2.032: 1 -3.81,-3.073; 2 -2.54,-3.073; 3 -1.27,-3.073; 4 0,-3.073; 5 1.27,-3.073; 6 2.54,-3.073; 7 3.81,-3.073; 8 3.81,3.073; 9 2.54,3.073; 10 1.27,3.073; 11 0,3.073; 12 -1.27,3.073; 13 -2.54,3.073; 14 -3.81,3.073
SO16 = smd 0.66 x 2.032: 1 -4.445,-3.073; 2 -3.175,-3.073; 3 -1.905,-3.073; 4 -0.635,-3.073; 5 0.635,-3.073; 6 1.905,-3.073; 7 3.175,-3.073; 8 4.445,-3.073; 9 4.445,3.073; 10 3.175,3.073; 11 1.905,3.073; 12 0.635,3.073; 13 -0.635,3.073; 14 -1.905,3.073; 15 -3.175,3.073; 16 -4.445,3.073
1X02 = drill 1.016 long: 1 -1.27,0; 2 1.27,0
CHIPLED_0805 = smd 1.2 x 1.2: A 0,-1.05; C 0,1.05
R0805 = smd 1.3 x 1.5: 1 -0.95,0; 2 0.95,0
SWITCH_SPDT_PTH_11.6X4.0MM = drill 1.016 pad 1.88: 1 0,2.54; 2 0,0; 3 0,-2.54
SD = smd 1.8 x 0.9: 1 -1,6.77; 2 -1,4.27; 3 -1,2.52; 4 -1,-0.73; 5 -1,-3.23; 6 -1,-5.73; 7 -1,-8.15; 8 -1,-9.85; 9 -1,9.27; CD -1,1.02 | smd 2 x 1.4: SH@1 20,14.496 | smd 2 x 1.527: SH@2 21.15,-13.589 | smd 1.8 x 1.1: WP -1,-13 | hole 1.55: 23.3,11.94; 23.3,-12.32
61400826021 = drill 0.92: 1 -3.5,7.11; 2 -1,7.11; 3 1,7.11; 4 3.5,7.11; 5 -3.5,4.49; 6 -1,4.49; 7 1,4.49; 8 3.5,4.49 | drill 2.3: S1 -6.57,7.46; S2 6.57,7.46; S3 -6.57,1.78; S4 6.57,1.78
L77HDE15SD1CH4RHNVGA = drill 1.19 pad 1.785 square: 1 0,5.08 | drill 1.19 pad 1.785: 2 -2.29,5.08; 3 -4.58,5.08; 4 -6.87,5.08; 5 -9.16,5.08; 6 1.145,2.54; 7 -1.145,2.54; 8 -3.435,2.54; 9 -5.725,2.54; 10 -8.015,2.54; 11 0,0; 12 -2.29,0; 13 -4.58,0; 14 -6.87,0; 15 -9.16,0 | drill 3.05 pad 4.575: MH1 8.17,2.54; MH2 -16.82,2.54

### Placement (x,y rotation side)
A  91.5,15 0 top
B  76.5,15 0 top
C1  3,62 0 bottom
C2  3,42.25 0 bottom
C3  3,59.5 0 bottom
C4  3,44.75 0 bottom
C5  88.25,47.25 270 top
C6  29.25,90 180 top
C7  63.75,24.75 180 top
C8  82.83,4.07 180 bottom
C9  56.75,12.5 180 bottom
C10  81.68,27.29 180 bottom
C11  69.87,5.74 90 top
CLOCK  86.5,25.25 0 top
CONTROLLERIN  64.99,22.52 180 top
COUNTER  35.25,4.75 0 top
CPU  45.1,55 90 top
DOWN  19.5,4.75 0 top
EXTENSION1  24.75,39.75 0 top
EXTENSION2  54,39.75 0 top
GPU  64.07,87.16 270 top
IC1  76.49,7.88 90 bottom
IC2  50,9.25 90 bottom
IC3  50,22.75 270 bottom
IC4  63.49,7.25 90 bottom
JP1  92.24,3.36 0 top
JP2  88.24,3.32 0 top
JP3  92.24,7.28 0 top
JP4  88.24,7.24 0 top
JP5  75.5,96.25 0 top
JP6  41.16,97.25 0 top
LED1  70.44,97.19 270 top
LED2  75.75,31.25 270 bottom
LED3  83.75,47.5 0 top
LEFT  7.25,17 90 top
POWERIN  96.75,43.47 90 top
R1  14.34,57.25 180 bottom
R2  13,40.84 90 bottom
R3  19.09,65.25 180 bottom
R4  16.34,50.06 180 bottom
R5  67.25,96.25 90 top
R6  43.76,89 270 top
R7  44.97,85.84 0 top
R8  46.3,89 270 top
R9  48.84,89 270 top
R10  51.08,89.01 270 top
R11  38.69,80.5 90 top
R12  38.25,83.67 180 top
R13  36.15,80.5 90 top
R14  33.58,80.5 90 top
R15  33.99,83.7 180 top
R16  64.06,80.5 90 top
R17  65.4,83.67 0 top
R18  66.61,80.5 90 top
R19  69.16,80.5 90 top
R20  72.36,79.93 180 top
R21  14,44.5 180 bottom
R22  18.25,45.75 180 bottom
R23  23.5,67.5 0 top
R24  16.25,61.75 180 bottom
R25  21,63 180 bottom
R26  79.75,31.25 0 bottom
R27  80.75,96.25 0 top
R28  85.97,47.25 90 top
R29  42.25,79.5 0 top
R30  54,95.75 90 bottom
R31  56.5,95.75 90 bottom
R32  59,95.75 90 bottom
R33  61.5,95.75 90 bottom
R54  29.5,84.5 90 top
R56  29.25,92.25 0 top
R61  42.76,6.91 0 bottom
R62  41.25,19 270 bottom
R63  78.75,19.25 270 bottom
R64  93.5,16.5 270 bottom
R65  29.5,17.5 270 bottom
R66  7.25,26 90 bottom
R67  22,7.5 0 bottom
R68  32.75,30 180 bottom
RIGHT  32,17 90 top
S1  88.25,52.25 270 top
SD-CARD  25.15,84.55 180 top
SELECT  50,7.25 180 top
START  50,22.5 180 top
UP  19.75,29.25 0 top
USB_C3-4  2,60.75 270 top
USBC1-2  2,43.5 270 top
VGA  91.25,75.75 90 top

### Tracks (layer width: path | path; a pad name or v marks a point on that pad's centre or on a via)
+3V3  (via drill 0.35)  (3 unrouted)
  Top 0.305: CPU.P$20 27.32,65.14 23.32,61.14 23.32,41.18 EXTENSION1.P$1 26.03,38.47 52.72,38.47 EXTENSION2.P$1 | GPU.P$23 36.43,90 C6.1 | R56.2 C6.1 | C6.1 29.95,89.75 29.95,85.9 R54.2 | R54.2 29.33,85.28 SD-CARD.4 | R54.2 28.95,86 v27.75,86
  Bottom 0.305: USBC1-2.5 USBC1-2.1 | USBC1-2.5 4.24,44.75 C4.1 C2.1 | USB_C3-4.5 USB_C3-4.1 8.58,64.25 | USB_C3-4.5 6.2,64.25 C1.1 C3.1 3.95,57.63 6.49,55.09 USBC1-2.5 | v27.75,86 25.15,86 7.34,68.2 7.34,65.1 USB_C3-4.5
+5V
  Top 0.305: R28.2 C5.1 S1.2
  pour Bottom: 100,34.75 0,34.75 0,100 100,100
A  (via drill 0.35)
  Top 0.305: v51.02,22.12 51.02,22.15 55.48,26.62 70.09,26.62 80.74,15.96 v83.71,15.96
  Bottom 0.305: IC3.12 v51.02,22.12 | v83.71,15.96 86.37,15.96 87.81,17.41 93.46,17.41 R64.1 93.55,17.5 A.3
B  (via drill 0.35)
  Top 0.305: v75.25,22.82 70.8,27.27 54.9,27.27 52.14,24.5 v50.29,24.5
  Bottom 0.305: IC3.13 47.04,23.5 49.29,23.5 v50.29,24.5 | v75.25,22.82 77.87,20.2 R63.1 80.05,20.2 B.3
BLUE_LSP
  Top 0.305: R16.1 GPU.P$13
BLUE_MMSP
  Top 0.305: GPU.P$14 R18.1
BLUE_MSP
  Top 0.305: GPU.P$15 R19.1
C1_DATA
  Bottom 0.305: USBC1-2.2 R21.1 13,44.45 R2.2
C2_DATA
  Bottom 0.305: USBC1-2.6 7.74,45.75 R22.1 R4.2
C3_DATA
  Bottom 0.305: USB_C3-4.2 R24.1 R1.2
C4_DATA
  Bottom 0.305: USB_C3-4.6 7.74,63 R25.1 R3.2
C_CLOCK
  Top 0.305: USBC1-2.7 USBC1-2.3 12.25,45.64 12.25,61.75 | USB_C3-4.7 USB_C3-4.3 10.25,59.75 12.25,61.75 | 12.25,61.75 12.25,66.5 13.25,67.5 R23.1
CONTROLLER_CLOCK  (via drill 0.35)
  Top 0.305: v65.08,14.58 65.06,14.59 65.06,18.64 CONTROLLERIN.3 | JP3.1 92.24,19.51 CLOCK.1
  Bottom 0.305: CLOCK.1 86.46,25.21 69.07,25.21 66.24,22.38 CONTROLLERIN.3 | v65.08,14.58 65.08,9.66 65.58,9.16 IC4.11 65.44,9.16 64.92,8.64 64.92,7.06 65.36,6.61 IC4.13
CONTROLLER_OUT
  Bottom 0.305: 81.16,9.65 80.66,9.15 IC1.10 | 81.16,9.65 81.16,12.21 77.37,16 70.92,16 70.89,15.96 69.61,15.96 68.9,16.68 67.37,16.68 CONTROLLERIN.2 | JP4.1 83.57,7.24 81.16,9.65
DOUBLE1
  Bottom 0.305: GPU.P$12 61.53,68.23 64.1,65.66 64.1,59.85 56.55,52.3 56.55,48.53 49.05,41.03 46.35,41.03 EXTENSION1.P$9
DOUBLE2
  Bottom 0.305: EXTENSION2.P$9 75.64,41.07 75.64,42.89 76.8,44.05 76.8,66.45 74.23,69.02 GPU.P$17
DOWN  (via drill 0.35)
  Top 0.305: v51.37,25.93 45.25,25.93 44.59,26.59 v41.3,26.59
  Bottom 0.305: R67.1 23.2,7.25 DOWN.3 25.75,22.75 29.59,26.59 v41.3,26.59 | IC3.2 v51.37,25.93
GND  (via drill 0.35)
  Bottom 0.305: R3.1 11.53,65.25 USB_C3-4.S1 | USBC1-2.4 12.89,40 R2.1 | R1.1 USB_C3-4.4 | USBC1-2.S1 R4.1 | C2.2 C4.2 2.05,46.15 3.78,47.88 USBC1-2.S3 | C3.2 C1.2 2.05,63.8 3.78,65.53 USB_C3-4.S3 | R30.2 R31.2 R32.2 R33.2 63.25,96.7 v63.25,96.75
  pour Top: 100,34.75 0,34.75 0,100 100,100
GNDA  (via drill 0.35)
  Top 0.305: C7.2 v61.25,24.75 | C11.2 69.87,7.57 69.39,8.05 v68.31,8.05
  pour Bottom (isolate 0.318): 0,0 100,0 100,33 0,33
GPU_MISO
  Top 0.305: CPU.P$12 47.64,76.47 47.61,76.5 47.61,77.5 56.45,86.34 GPU.P$30
  Bottom 0.305: GPU.P$30 56.45,94.75 R31.1
GPU_MOSI
  Top 0.305: GPU.P$29 53.91,86.91 45.07,78.07 45.07,65.19 CPU.P$13
  Bottom 0.305: GPU.P$29 53.91,94.71 R30.1
GPU_READY  (via drill 0.35)
  Top 0.305: CPU.P$37 31.12,53.73 v31.12,63.97 | v34.25,95 34.3,95.05 67,95.05 R5.1 67.3,95.25 v71.25,95.25
  Bottom 0.305: v31.12,63.97 31.12,91.88 v34.25,95 | v71.25,95.25 71.25,95.22 GPU.P$37
GPU_SCK
  Top 0.305: CPU.P$11 50.15,65.19 50.15,78.15 58.99,86.99 GPU.P$31
  Bottom 0.305: GPU.P$31 R32.1
GPU_SS
  Top 0.305: CPU.P$10 52.72,76.47 52.69,76.5 52.69,77.94 61.53,86.78 GPU.P$32
  Bottom 0.305: GPU.P$32 61.5,92.27 R33.1
GREEN_LSP
  Top 0.305: GPU.P$3 38.67,79.53 R11.1
GREEN_MMSP
  Top 0.305: GPU.P$2 36.13,79.53 R13.1
GREEN_MSP
  Top 0.305: GPU.P$1 R14.1
HOT_PLUG1  (via drill 0.35)
  Top 0.305: v59,59.84 59.02,59.86 59.02,66.23 v59,66.25
  Bottom 0.305: v59,66.25 GPU.P$11 | v59,59.84 50.91,51.75 47.75,51.75 46.42,50.42 46.42,49.52 43.08,46.17 37.07,46.17 33.59,42.69 33.59,41.72 32.37,40.5 EXTENSION1.P$4
HOT_PLUG2  (via drill 0.35)
  Top 0.305: EXTENSION2.P$4 65.28,36.09 78.38,36.09 80.52,38.23 80.52,61.95 73.5,68.96 v72.96,68.96
  Bottom 0.305: GPU.P$16 71.69,70.23 v72.96,68.96
HSYNC  (via drill 0.35)
  Top 0.305: v57.25,75 75,75 85.26,64.74 92.06,64.74 93.1,65.78 93.1,69.32 VGA.13
  Bottom 0.305: GPU.P$5 45.75,75 v57.25,75
ID0_1
  Bottom 0.305: GPU.P$36 71.69,78.94 70.47,77.72 70.47,70.03 74.26,66.24 74.26,44.01 73,42.75 73,39 70.1,36.09 38.57,36.09 EXTENSION1.P$5
ID0_2
  Top 0.305: EXTENSION2.P$5 67.21,36.7 78.12,36.7 79.91,38.49 79.91,49.9 70.81,59 58.65,59 53.94,63.71 53.94,76.97 GPU.P$9
ID1_1
  Bottom 0.305: GPU.P$35 69.15,78.9 67.93,77.68 67.93,69.45 71.72,65.66 71.72,43.95 70.5,42.73 70.5,39.29 67.92,36.7 40.5,36.7 EXTENSION1.P$6
ID1_2
  Top 0.305: EXTENSION2.P$6 69.14,37.31 77.87,37.31 79.3,38.74 79.3,49.65 70.7,58.25 57.91,58.25 51.42,64.73 51.42,76.95 GPU.P$8
ID2_1
  Bottom 0.305: GPU.P$34 66.61,78.86 65.39,77.64 65.39,69.45 69.18,65.66 69.18,43.95 68,42.77 68,39.33 65.99,37.31 42.43,37.31 EXTENSION1.P$7
ID2_2
  Top 0.305: EXTENSION2.P$7 71.07,37.92 77.62,37.92 78.69,38.99 78.69,49.4 70.48,57.61 56.01,57.61 48.86,64.75 48.86,76.97 GPU.P$7
ID3_1
  Bottom 0.305: GPU.P$33 64.07,78.82 62.85,77.6 62.85,69.45 66.64,65.66 66.64,43.95 65.48,42.8 65.48,39.35 64.06,37.92 43.11,37.92 42.53,38.5 EXTENSION1.P$8
ID3_2
  Top 0.305: EXTENSION2.P$8 73,38.53 77.36,38.53 78.08,39.24 78.08,49.14 70.22,57 54.08,57 46.32,64.76 46.32,76.97 GPU.P$6
LEFT
  Bottom 0.305: LEFT.3 6.55,25.05 R66.1 26.97,25.05 29.91,27.98 48.13,27.98 51.46,24.66 IC3.3
N$1
  Top 0.305: R5.2 69.38,97.2 LED1.A
N$2
  Bottom 0.305: R26.2 LED2.A
N$3
  Top 0.305: POWERIN.1 90.79,45.97 S1.1
N$4
  Top 0.305: LED3.A 83.9,46.3 R28.1
N$11  (via drill 0.35)
  Top 0.305: v49.49,11.23 49.56,11.23 49.61,11.29 68.35,11.29 70.53,9.11 v71.13,9.11
  Bottom 0.305: v49.49,11.23 48.15,9.89 IC2.5 | v71.13,9.11 71.17,9.15 IC1.5
N$15  (via drill 0.35)
  Top 0.305: v71.04,10.44 70.06,10.44 68.61,11.9 66.55,11.9 v56.32,22.13
  Bottom 0.305: v56.32,22.13 53.09,22.13 IC3.5 | v71.04,10.44 73.4,10.44 IC1.6
N$16
  Top 0.305: R7.1 43.76,86.1 R6.2
N$17
  Bottom 0.305: IC1.8 IC1.9 77.86,10.42 75.32,7.88 IC1.4
N$18
  Top 0.305: R12.1 39.2,81.97 R11.2
N$21
  Top 0.305: R17.1 64.06,83.28 R16.2
N$24
  Bottom 0.305: COUNTER.1 31.44,12.19 40.79,21.54 45.48,21.54 46.18,20.84 IC3.11 46.94,20.86 48.38,20.86 50.19,19.05 50.19,15.53 52.03,13.7 IC2.9 54.95,13.7 54.96,13.71 61.72,13.71 63.39,12.04 63.39,6.09 65.41,4.07 IC4.15
N$25
  Bottom 0.305: IC4.1 58.7,2.8 57.81,1.91 36.82,1.91 COUNTER.2 33.98,5.95 36.14,8.11 36.14,10.18 45.54,19.57 IC3.10 48.33,19.57 49.35,18.56 49.35,15.01 51.93,12.43 IC2.10
N$26
  Bottom 0.305: IC4.2 60.34,4 58.78,4 57.3,2.52 38.05,2.52 36.52,4.05 COUNTER.3 36.52,7.54 45.13,16.14 45.13,17.82 45.61,18.3 IC3.9 48.25,18.3 48.73,17.82 48.73,14.24 51.81,11.16 IC2.11
N$27  (via drill 0.35)
  Top 0.305: v71.4,5.4 71.4,3.25 70.19,2.04 65.16,2.04 v62.4,4.8
  Bottom 0.305: IC2.7 46.9,12.45 42.31,12.45 39.06,9.2 COUNTER.4 40.6,3.21 56.89,3.21 59.02,5.34 IC4.3 61.85,5.34 v62.4,4.8 | IC1.3 IC1.2 73.42,5.4 v71.4,5.4
N$29
  Bottom 0.305: IC1.1 71.09,4.07 69.24,5.92 69.24,10.44 68.04,11.64 68.04,12.86 65.49,15.41 58.51,15.41 54.34,19.57 IC3.7
PA8_CPU  (via drill 0.35)
  Top 0.305: v55.75,67.5 63.08,67.5 CPU.P$5 | v33.75,67.5 R23.2
  Bottom 0.305: v33.75,67.5 v55.75,67.5
PA9_CPU
  Bottom 0.305: CPU.P$6 50.22,52.5 28.18,52.5 20.18,44.5 R21.2
PA9_CPU1
  Bottom 0.305: CPU.P$8 54.39,61.75 R24.2
PA10_CPU
  Bottom 0.305: CPU.P$7 49.43,54.25 29.06,54.25 20.56,45.75 R22.2
PA10_CPU1
  Bottom 0.305: CPU.P$9 53.1,63 R25.2
PC14_GPU
  Top 0.305: R27.1 JP5.2
  Bottom 0.305: GPU.P$38 JP5.2
PC14_GPU2  (via drill 0.35)
  Top 0.305: GPU.P$4 41.21,79.41 R29.1 41.3,83.95 v41.25,84
  Bottom 0.305: v41.25,84 42.43,85.18 JP6.2
RED_LSP
  Top 0.305: R6.1 GPU.P$25
RED_MMSP
  Top 0.305: R8.1 GPU.P$26
RED_MSP
  Top 0.305: R9.1 GPU.P$27
RIGHT  (via drill 0.35)
  Top 0.305: v50.91,23.44 50.89,23.46 36.97,23.46 35.64,24.79 31.04,24.79 RIGHT.3
  Bottom 0.305: R65.1 RIGHT.3 | IC3.4 50.96,23.38 v50.91,23.44
SDCLK  (via drill 0.35)
  Top 0.305: CPU.P$2 65.7,72.5 v55.75,72.5 | v43,72.5 25.43,72.5 24.54,73.39 24.54,87.17 25.15,87.78 SD-CARD.5
  Bottom 0.305: v55.75,72.5 v43,72.5
SDCMD  (via drill 0.35)
  Top 0.305: CPU.P$4 64.37,68.75 v55.75,68.75 | SD-CARD.2 27.22,80.28 v32.5,75
  Bottom 0.305: v55.75,68.75 38.75,68.75 v32.5,75
SDHP  (via drill 0.35)
  Top 0.305: v28.56,63.91 28.56,53.76 CPU.P$38 | R54.1 29.48,83.53 | 29.48,83.53 SD-CARD.CD | v29.54,80.34 29.54,83.48 29.48,83.53
  Bottom 0.305: v29.54,80.34 29.54,67.04 28.56,66.06 v28.56,63.91
SDIN  (via drill 0.35)
  Top 0.305: CPU.P$1 66.74,74 v55.75,74 | v43,74 30.68,74 26.9,77.78 SD-CARD.1
  Bottom 0.305: v55.75,74 v43,74
SDOUT  (via drill 0.35)
  Top 0.305: CPU.P$3 65.66,70 v55.75,70 | v43,70 26.18,70 23.18,73 23.18,91.49 24.4,92.7 SD-CARD.7 27.85,92.7 R56.1
  Bottom 0.305: v55.75,70 v43,70
SELECT  (via drill 0.35)
  Top 0.305: v41.48,9.5 41.48,22.33 v41.52,22.37
  Bottom 0.305: v41.52,22.37 41.52,25.01 43.15,26.64 44.65,26.64 45.37,25.93 IC3.15
  Bottom 0.406: SELECT.3 43.75,6.87 R61.1 43.71,7.25 v41.48,9.48 v41.48,9.5
SIG0_1
  Bottom 0.305: EXTENSION1.P$11 31.16,48.7 36.26,48.7 CPU.P$36
SIG0_2
  Bottom 0.305: EXTENSION2.P$11 54,43.29 57.8,47.09 CPU.P$28
SIG1_1
  Bottom 0.305: EXTENSION1.P$12 33,48 38.25,48 40.02,49.77 CPU.P$35
SIG1_2
  Bottom 0.305: CPU.P$27 60.34,47.09 56.54,43.29 EXTENSION2.P$12
SIG2_1
  Bottom 0.305: EXTENSION1.P$13 34.93,47.39 39.97,47.39 42.49,49.92 CPU.P$34
SIG2_2
  Bottom 0.305: EXTENSION2.P$13 59.08,43.04 62.88,46.84 CPU.P$26
SIG3_1
  Bottom 0.305: CPU.P$33 45.03,49.92 41.9,46.78 36.11,46.78 32.37,43.04 EXTENSION1.P$14
SIG3_2
  Bottom 0.305: EXTENSION2.P$14 61.62,43.04 65.42,46.84 CPU.P$25
SIG4_1
  Bottom 0.305: CPU.P$32 47.64,49.87 43.33,45.56 38.18,45.56 EXTENSION1.P$15
SIG4_2
  Top 0.305: CPU.P$17 46.6,53.5 61.02,53.5 64.16,50.36 EXTENSION2.P$15
SIG5_1
  Bottom 0.305: EXTENSION1.P$16 40.11,44.95 45.15,44.95 50.11,49.92 CPU.P$31
SIG5_2
  Top 0.305: CPU.P$16 48.14,54.5 62.56,54.5 66.7,50.36 EXTENSION2.P$16
SIG6_1
  Bottom 0.305: EXTENSION1.P$17 42.04,44.34 47.08,44.34 52.65,49.92 CPU.P$30
SIG6_2
  Top 0.305: CPU.P$15 49.68,55.5 64.1,55.5 69.24,50.36 EXTENSION2.P$17
SIG7_1
  Bottom 0.305: EXTENSION1.P$18 43.97,43.73 49.01,43.73 55.19,49.92 CPU.P$29
SIG7_2
  Top 0.305: CPU.P$14 51.47,56.25 65.89,56.25 71.78,50.36 EXTENSION2.P$18
START  (via drill 0.35)
  Top 0.305: v45.12,22.37 45.12,21.37 START.3
  Bottom 0.305: R62.1 41.3,20 START.3 | IC3.14 46.87,24.6 45.6,24.6 45.12,24.12 v45.12,22.37
UP
  Bottom 0.305: 31.75,28.59 48.44,28.59 49.83,27.2 IC3.1 | 31.75,28.59 29.16,28.59 UP.3 | R68.1 31.8,28.64 31.75,28.59
VCC  (via drill 0.35)
  Bottom 0.305: IC2.16 51.7,4.8 51.25,5.25 v51.25,9.5 51.63,9.89 IC2.12 54.1,9.89 55.8,11.59 C9.1 | IC4.10 67.83,10.43 v68.31,9.95 | v81.89,5.63 81.88,5.62 C8.1 IC1.14 | v68.34,2.87 66.63,2.87 IC4.16 | IC3.16 48.05,27.2 49.25,26 v49.25,25 | C10.1 78.99,27.29 v78.97,27.27 | R26.1 v82.5,31.25
  pour Top: 0,33 0,0 100,0 100,33
VGA_BLUE
  Top 0.305: R19.2 R18.2 66.35,81.7 R17.2 | R20.2 69.89,81.45 R19.2 | VGA.3 83.07,74.27 83.07,77.5 79.12,81.45 R19.2
VGA_GREEN  (via drill 0.35)
  Top 0.305: R15.2 33.04,81.99 R14.2 R13.2 37.3,82.6 R12.2 38.09,84.46 38.09,84.61 38.48,85 42.82,85 43.18,84.64 46.76,84.64 47.12,85 v50.75,85 | VGA.2 85.17,73.46 83.92,74.71 83.92,77.57 76.49,85 v61.5,85
  Bottom 0.305: v61.5,85 v50.75,85
VGA_RED  (via drill 0.35)
  Top 0.305: R7.2 45.92,87.67 R8.2 R9.2 R10.2 51.08,87.17 v52,86.25 | VGA.1 86.17,76.75 76.67,86.25 v62.25,86.25
  Bottom 0.305: v52,86.25 v62.25,86.25
VSYNC  (via drill 0.35)
  Top 0.305: v94,71.5 94,83.01 83.05,93.96 53.09,93.96 GPU.P$28
  Bottom 0.305: VGA.14 91.38,68.88 v94,71.5
(copper drawn outside any net)
  shapes: Top area x3

### Text on the board
FANCY_ICONS: This board was made by menga-team™ / check us out at https://github.com/menga-team/ / check the board out at https://github.com/menga-team/MES / check the svg 2 polygon converter at https://github.com/menga-team/svg2eagle | This board was made by menga-team™ / check us out at https://github.com/menga-team/ / check the board out at https://github.com/menga-team/MES / check the svg 2 polygon converter at https://github.com/menga-team/svg2eagle